# EAGLE schematic BT_module (EAGLE 9.6.2)
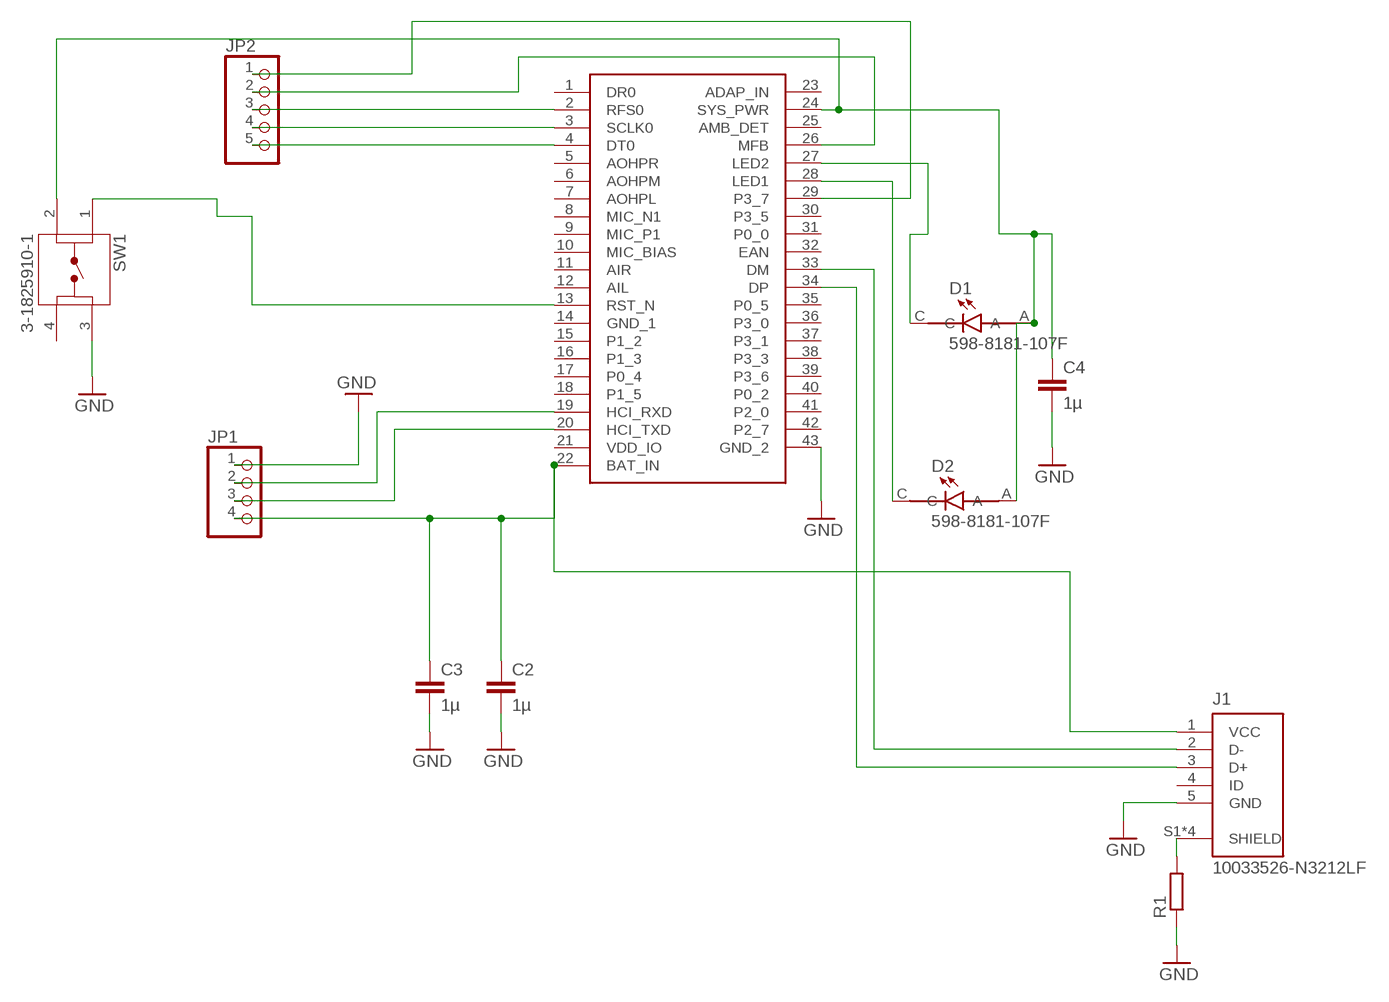
[diagram p0: schematic, sheet 1]

## Parts
ANT2  BM64SPKS1MC2-0001AA  [BM64SPKS1MC20001AA]
C2  1µ  C-EUC0805  [C0805]
C3  1µ  C-EUC0805  [C0805]
C4  1µ  C-EUC0805  [C0805]
D1  598-8181-107F  [LEDC2012X70N]
D2  598-8181-107F  [LEDC2012X70N]
J1  10033526-N3212LF  [AMPHENOL_10033526-N3212LF]
JP1  PINHD-1X4  [1X04]
JP2  PINHD-1X5  [1X05]
R1  R-EU_M0805  [M0805]
SW1  3-1825910-1  [TE_3-1825910-1]

## Nets
GND: ANT2.43(GND_2) C2.2 C3.2 C4.2 J1.5(GND) JP1.1 R1.1 SW1.3
N$1: ANT2.29(P3_7) JP2.1
N$2: J1.S1(SHIELD) J1.S2(SHIELD) J1.S3(SHIELD) J1.S4(SHIELD) R1.2
N$3: ANT2.27(LED2) D1.C
N$4: ANT2.28(LED1) D2.C
N$5: ANT2.24(SYS_PWR) C4.1 D1.A D2.A SW1.2
N$6: ANT2.2(RFS0) JP2.3
N$7: ANT2.3(SCLK0) JP2.4
N$8: ANT2.33(DM) J1.2(D-)
N$9: ANT2.13(RST_N) SW1.1
N$10: ANT2.4(DT0) JP2.5
N$11: ANT2.22(BAT_IN) C2.1 C3.1 J1.1(VCC) JP1.4
N$13: ANT2.26(MFB) JP2.2
N$14: ANT2.19(HCI_RXD) JP1.2
N$15: ANT2.20(HCI_TXD) JP1.3
N$16: ANT2.34(DP) J1.3(D+)
Unconnected: ANT2.1(DR0) ANT2.5(AOHPR) ANT2.6(AOHPM) ANT2.7(AOHPL) ANT2.8(MIC_N1) ANT2.9(MIC_P1) ANT2.10(MIC_BIAS) ANT2.11(AIR) ANT2.12(AIL) ANT2.14(GND_1) ANT2.15(P1_2) ANT2.16(P1_3) ANT2.17(P0_4) ANT2.18(P1_5) ANT2.21(VDD_IO) ANT2.23(ADAP_IN) ANT2.25(AMB_DET) ANT2.30(P3_5) ANT2.31(P0_0) ANT2.32(EAN) ANT2.35(P0_5) ANT2.36(P3_0) ANT2.37(P3_1) ANT2.38(P3_3) ANT2.39(P3_6) ANT2.40(P0_2) ANT2.41(P2_0) ANT2.42(P2_7) J1.4(ID) SW1.4

## Library data of the parts
ANT2 = BM64SPKS1MC2-0001AA:BM64SPKS1MC2-0001AA: BT4.2 Stereo Audio with BLE, I2S, Flash, Source: Datasheet <http://ww1.microchip.com/downloads/en/DeviceDoc/BM62-64-Bluetooth-Stereo-Audio-Module-Data-Sheet-DS60001403E.pdf> Check prices <https://pricing.snapeda.com/parts/BM64SPKS1MC2-0001AA/Microchip/view-part?ref=eda>; AVAILABILITY: Warning; DESCRIPTION: Bluetooth Bluetooth v5.0 Transceiver Module 2.4GHz Integrated, Trace Surface Mount; MF: Microchip; MP: BM64SPKS1MC2-0001AA; PACKAGE: Module Microchip; PRICE: None; PURCHASE-URL: https://pricing.snapeda.com/search/part/BM64SPKS1MC2-0001AA/?ref=eda
C2-C4 = rcl:C-EU: CAPACITOR, European symbol; SPICEPREFIX: C
D1 D2 = 598-8181-107F:598-8181-107F: SM LED 0805 INGAN G 7 REEL Check prices <https://pricing.snapeda.com/parts/598-8181-107F/Dialight/view-part?ref=eda>; AVAILABILITY: Good; DESCRIPTION: Green 523nm LED Indication - Discrete 3.2V 0805 (2012 Metric); MF: Dialight; MP: 598-8181-107F; PACKAGE: 0805 Dialight; PRICE: None; PURCHASE-URL: https://pricing.snapeda.com/search/part/598-8181-107F/?ref=eda
J1 = 10033526-N3212LF:10033526-N3212LF: USB - mini B Receptacle Connector 5 Position Surface Mount, Right Angle Check prices <https://pricing.snapeda.com/parts/10033526-N3212LF/Amphenol%20ICC%20%28FCI%29/view-part?ref=eda>; AVAILABILITY: Good; DESCRIPTION: USB - mini B Receptacle Connector 5 Position Surface Mount, Right Angle; MF: Amphenol ICC (FCI); MP: 10033526-N3212LF; PACKAGE: None; PRICE: None; PURCHASE-URL: https://pricing.snapeda.com/search/part/10033526-N3212LF/?ref=eda
JP1 = pinhead:PINHD-1X4: PIN HEADER
JP2 = pinhead:PINHD-1X5: PIN HEADER
R1 = rcl:R-EU_: RESISTOR, European symbol; SPICEPREFIX: R
SW1 = 3-1825910-1:3-1825910-1: Switch Tactile OFF (ON) SPST Round Button PC Pins 0.05A 24VDC 100000Cycles 1.57N Thru-Hole Loose Check prices <https://pricing.snapeda.com/parts/3-1825910-1/TE%20Connectivity/view-part?ref=eda>; AVAILABILITY: Good; COMMENT: 3-1825910-1; DESCRIPTION: Switch Push Button OFF (ON) SPST Round Button 0.05A 24VDC Momentary Contact PC Pins Thru-Hole; EU_ROHS_COMPLIANCE: Compliant; MF: TE Connectivity; MP: 3-1825910-1; PACKAGE: None; PRICE: None; PURCHASE-URL: https://pricing.snapeda.com/search/part/3-1825910-1/?ref=eda

## Net classes
0 default: width 0.406 mm, drill 0.508 mm, clearance 0.254 mm
1 short: width 0.305 mm, drill 0.508 mm, clearance 0.254 mm